# Altium schematic sheet Sensors.SchDoc
size Letter
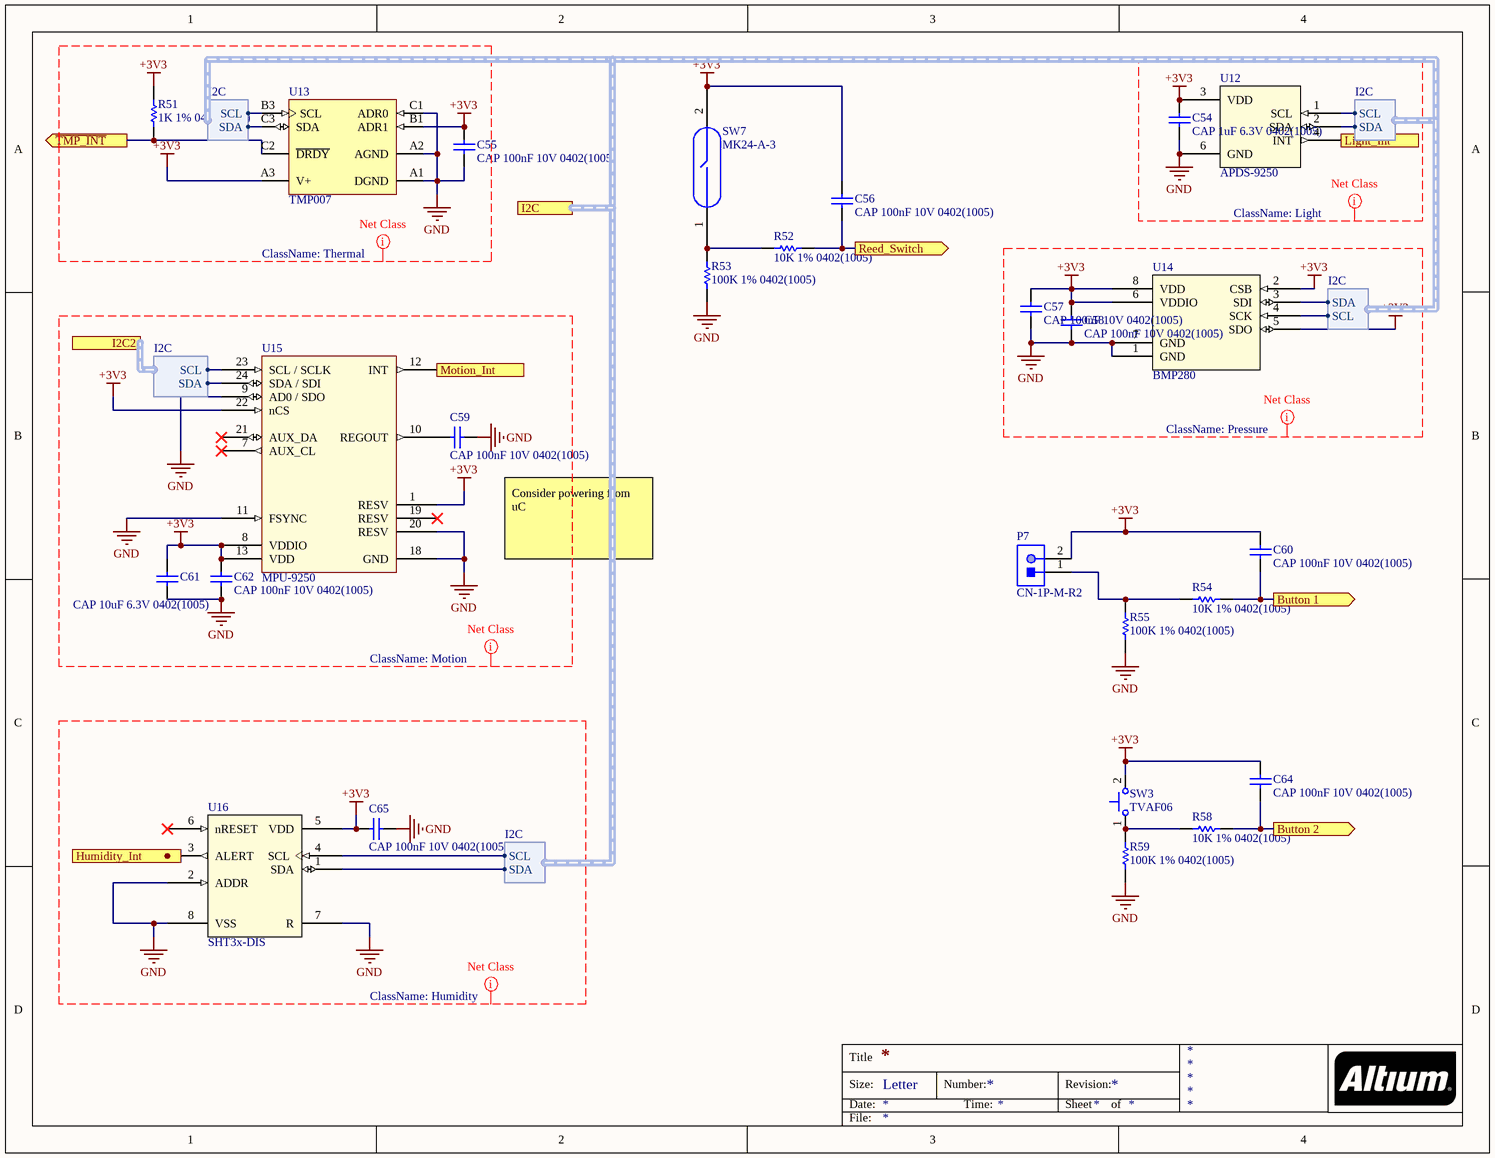
[diagram p0: Sensors.SchDoc]

## Parts
C54  CAP 1uF 6.3V 0402(1005)  [CAPC0402(1005)60_L]
C55  CAP 100nF 10V 0402(1005)  [CAPC0402(1005)60_L]
C56  CAP 100nF 10V 0402(1005)  [CAPC0402(1005)60_L]
C57  CAP 100nF 10V 0402(1005)  [CAPC0402(1005)60_L]
C58  CAP 100nF 10V 0402(1005)  [CAPC0402(1005)60_L]
C59  CAP 100nF 10V 0402(1005)  [CAPC0402(1005)60_L]
C60  CAP 100nF 10V 0402(1005)  [CAPC0402(1005)60_L]
C61  CAP 10uF 6.3V 0402(1005)  [CAPC0402(1005)60_L]
C62  CAP 100nF 10V 0402(1005)  [CAPC0402(1005)60_L]
C64  CAP 100nF 10V 0402(1005)  [CAPC0402(1005)60_L]
C65  CAP 100nF 10V 0402(1005)  [CAPC0402(1005)60_L]
P7  CN-1P-M-R2  [B2B-PH-K-S]
R51  1K 1% 0402(1005)  [RESC0402(1005)_L]
R52  10K 1% 0402(1005)  [RESC0402(1005)_L]
R53  100K 1% 0402(1005)  [RESC0402(1005)_L]
R54  10K 1% 0402(1005)  [RESC0402(1005)_L]
R55  100K 1% 0402(1005)  [RESC0402(1005)_L]
R58  10K 1% 0402(1005)  [RESC0402(1005)_L]
R59  100K 1% 0402(1005)  [RESC0402(1005)_L]
SW3  TVAF06  [JNFU-TVAF06_V]
SW7  MK24-A-3  [MK24]
U12  APDS-9250  [SON65P200X75-6N]
U13  TMP007  [YZF0008AHAH]
U14  BMP280  [LGA4C65P2X4_200X250X95]
U15  MPU-9250  [QFN40P300X300X105_HS-25N]
U16  SHT3x-DIS  [SHT3x-DIS]

## Ports
Button 1 (out), Button 2 (out), Humidity_Int (out), I2C2 (harness I2C), I2C (harness I2C), Light_Int (out), Motion_Int (out), Reed_Switch (out), ~{TMP_INT} (out)

## Harnesses
I2C: SDA, SCL
I2C: SCL, SDA

## Nets
+3V3: C54.2 C55.2 C56.2 C57.2 C58.2 C60.2 C61.2 C62.2 C64.2 C65.1 P7.2 R51.2 SW3.2 SW7.2 U12.3(VDD) U13.A3(V+) U13.B1(ADR1) U14.2(CSB) U14.5(SDO) U14.6(VDDIO) U14.8(VDD) U15.1(RESV) U15.8(VDDIO) U15.13(VDD) U15.22(nCS) U16.5(VDD)
GND: C54.1 C55.1 C57.1 C58.1 C59.2 C61.1 C62.1 C65.2 R53.2 R55.2 R59.2 U12.6(GND) U13.A1(DGND) U13.A2(AGND) U13.C1(ADR0) U14.1(GND) U14.7(GND) U15.9(AD0_/_SDO) U15.11(FSYNC) U15.18(GND) U15.20(RESV) U16.2(ADDR) U16.7(R) U16.8(VSS)
Button 1: C60.1 R54.2 ; port Button 1
Button 2: C64.1 R58.2 ; port Button 2
Light_Int: U12.4(INT) ; port Light_Int
Motion_Int: U15.12(INT) ; port Motion_Int
Reed_Switch: C56.1 R52.2 ; port Reed_Switch
~{TMP_INT}: R51.1 U13.C2(~{DRDY}) ; port ~{TMP_INT}
NetC59_1: C59.1 U15.10(REGOUT)
NetP7_1: P7.1 R54.1 R55.1
NetR52_1: R52.1 R53.1 SW7.1
NetR58_1: R58.1 R59.1 SW3.1
NetU12_1: U12.1(SCL) U13.B3(SCL) U14.4(SCK) U16.4(SCL) ; port I2C.SCL
NetU12_2: U12.2(SDA) U13.C3(SDA) U14.3(SDI) U16.1(SDA) ; port I2C.SDA
NetU15_23: U15.23(SCL_/_SCLK) ; port I2C2.SCL
NetU15_24: U15.24(SDA_/_SDI) ; port I2C2.SDA

Not connected (* = marked no-connect by the designer): U15 7(AUX_CL)* 19(RESV)* 21(AUX_DA)*; U16 3(ALERT) 6(nRESET)*

## Layout directives
net class Motion: +3V3, GND
net class Thermal: +3V3, GND
net class Humidity: +3V3, GND
net class Pressure: +3V3, GND
net class Light: +3V3, GND

## Notes on the sheet
- Consider powering from uC
- Title
- Size:
- Date:
- Letter
- Number:
- Time:
- Revision:
- Sheet
- of
- File:

## Library data of the parts
C54 = CMP-1034-02115-1: CAP 1uF 6.3V -20% to +80% 0402 (1005 Metric) Thickness 0.6mm SMD; Case-Metric: 1005; Case-EIA: 0402; Value: 1uF; Tolerance: -20% to +80%; Rated Voltage: 6.3 V; Max Thickness: 0.6 mm; Technology: SMT
C55-C60 C62 C64 C65 = CMP-1034-02066-1: CAP 100nF 10V ±20% 0402 (1005 Metric) Thickness 0.6mm SMD; Tolerance: Â±20%; Case-Metric: 1005; Case-EIA: 0402; Max Thickness: 0.6 mm; Rated Voltage: 10 V; Technology: SMT; Value: 100nF
C61 = CMP-1034-02138-1: CAP 10uF 6.3V ±20% 0402 (1005 Metric) Thickness 0.6mm SMD; Case-Metric: 1005; Case-EIA: 0402; Tolerance: Â±20%; Rated Voltage: 6.3 V; Technology: SMT; Max Thickness: 0.6 mm; Value: 10uF
R51 = CMP-1011-00510-1: 1K 0.063W 1% 0402 (1005 Metric)  SMD; Case-Metric: 1005; Case-EIA: 0402; Value: 1000.00 Ohm; Technology: SMT; Tolerance: 1 %; Power: 0.063 W
R52 R54 R58 = CMP-1011-00623-1: 10K 0.063W 1% 0402 (1005 Metric)  SMD; Case-EIA: 0402; Value: 10000.00 Ohm; Case-Metric: 1005; Technology: SMT; Tolerance: 1 %; Power: 0.063 W
R53 R55 R59 = CMP-1011-00736-1: 100K 0.063W 1% 0402 (1005 Metric)  SMD; Value: 100000.00 Ohm; Case-Metric: 1005; Case-EIA: 0402; Power: 0.063 W; Tolerance: 1 %; Technology: SMT
SW3 = CMP-0587-00001-2: Switch, SPST Push Button, 50 mA, 12 V DC, SMD, -30 to 85 degC, RoHS; Manufacturer: Jianfu; Contact Resistance: 100 mW max; Lifetime: 100000 Cycles min; Rating: 50 mA. 12 V DC; Insulation Resistance: 100 MW min. 100 V DC; Travel: 0.13 +/- 0.05 mm; Dielectric Strength: 250 V AC for 1 min; RoHS: TRUE; Mounting Technology: Surface Mount; PartNumber: TVAF06; PackageDescription: 2-Pin Switch, Push Button, SMD, Body 2.9 x 3.9 mm; ComponentLink1Description: Manufacturer URL; ComponentLink1URL: http://www.jian-fu.com/; Operating Temperature: -30 to 85 degC; ComponentLink2URL: http://en.jian-fu.com/product-22.html; PackageReference: TVAF06; ComponentLink2Description: Datasheet
SW7 = MK24
U12 = APDS-9250: Digital RGB, IR and Ambient Light Sensor
U13 = CMP-0978-00001-2: Infrared Thermopile Sensor, 2.2 to 3.6 V, 240 uA, -40 to 125 degC, 8-Pin BGA (YZF8), Green (RoHS & no Sb/Br), Tape and Reel; Manufacturer: Texas Instruments; Temp Resolution (Max): 14 Bit; Supply Current (Typ): 240 uA; Two-Wire Interface Voltage: 3.3 V; ComponentLink3URL: http://www.ti.com/lit/ml/mxbg053j/mxbg053j.pdf; ComponentLink2URL: http://www.ti.com/lit/ds/sbos518c/sbos518c.pdf; RoHS: TRUE; Packing: Tape and Reel; Supply Voltage: 2.2 to 3.6 V; Temperature Range: -40 to 125 degC; DatasheetVersion: SBOS518C; PartNumber: TMP007; Mounting Technology: Surface Mount; PackageReference: YZF0008AHAH; PackageVersion: 4205058-3/P; ComponentLink1URL: http://www.ti.com/; ComponentLink1Description: Manufacturer URL; ComponentLink2Description: Datasheet; PackageDescription: 8-Pin Ball Grid Array, Body 1.5345 x 1.5345 mm, Pitch 0.5 mm; ComponentLink3Description: Package Specification
U14 = BMP280: Digital Pressure Sensor
U15 = MPU-9250: MPU-9250 Nine-Axis (Gyro + Accelerometer + Compass) MEMS MotionTracking™ Device
U16 = SHT3x: Humidity and Temperature Sensor